# EAGLE design extruder-controller (EAGLE 5.02)
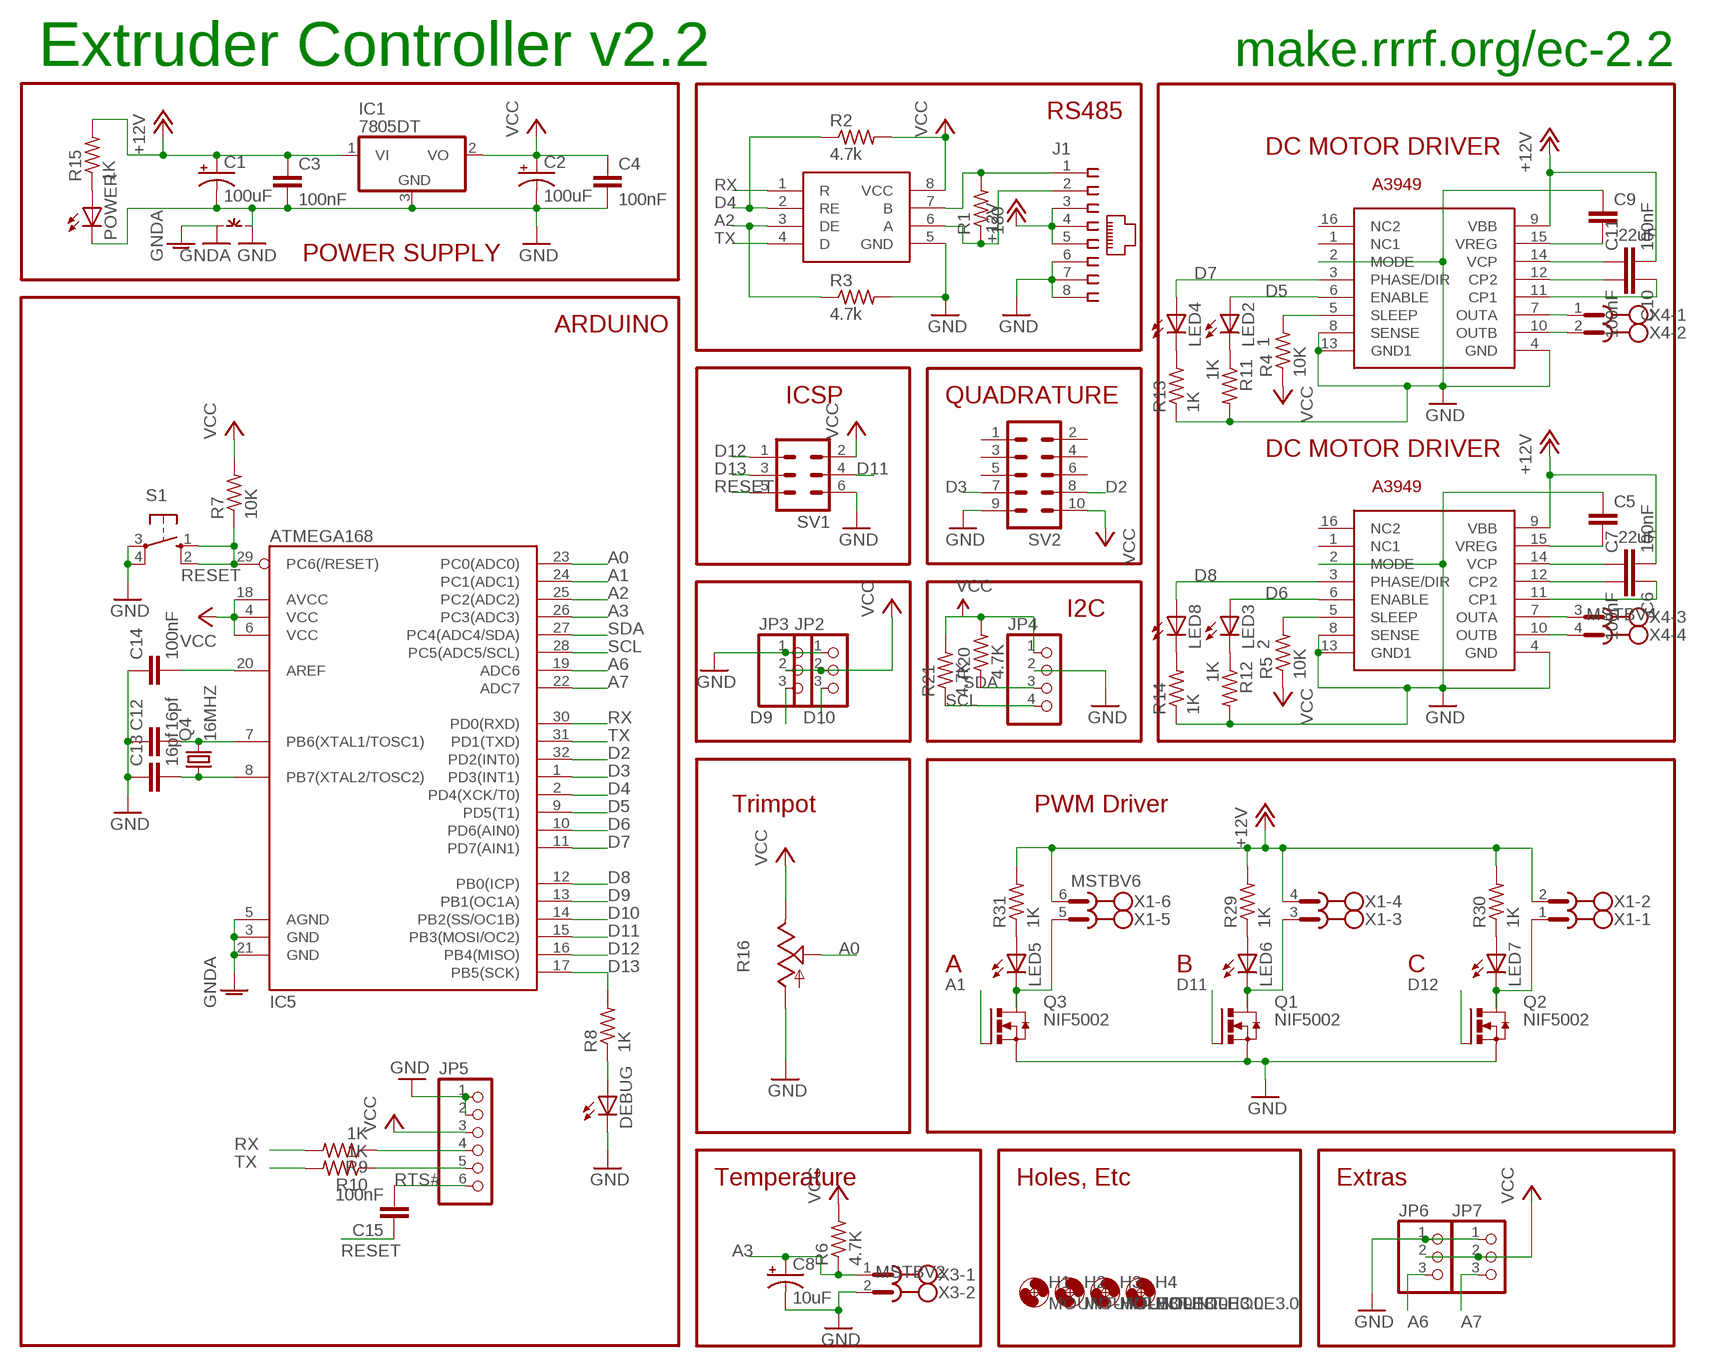
[diagram p0: schematic, sheet 1]

## Parts
C1  100uF  CPOL-USUD-10X10  [UD-10X10_NICHICON]
C2  100uF  CPOL-USUD-10X10  [UD-10X10_NICHICON]
C3  100nF  C-EUC1206  [C1206]
C4  100nF  C-EUC1206  [C1206]
C5  .22uF  C-EUC1206K  [C1206K]
C6  100nF  C-EUC1206K  [C1206K]
C7  100nF  C-EUC1206K  [C1206K]
C8  10uF  CPOL-USUD-6,3X5,8  [UD-6,3X5,8_NICHICON]
C9  .22uF  C-EUC1206K  [C1206K]
C10  100nF  C-EUC1206K  [C1206K]
C11  100nF  C-EUC1206K  [C1206K]
C12  16pf  C-EUC1206  [C1206]
C13  16pf  C-EUC1206  [C1206]
C14  100nF  C-EUC1206  [C1206]
C15  100nF  C-EUC1206  [C1206]
DEBUG  LEDCHIPLED_1206  [CHIPLED_1206]
H1  MOUNT-HOLE3.0  [3,0]
H2  MOUNT-HOLE3.0  [3,0]
H3  MOUNT-HOLE3.0  [3,0]
H4  MOUNT-HOLE3.0  [3,0]
IC1  7805DT  [TO252]
IC2  A3949  [SO16W]
IC3  A3949  [SO16W]
IC4  SN75176ASOIC  [SO08]
IC5  ATMEGA168  [TQFP32-08]
J1  520426-4  [520426-4]
JP2  PINHD-1X3  [1X03]
JP3  PINHD-1X3  [1X03]
JP4  PINHD-1X4  [1X04]
JP5  PINHD-1X6  [1X06]
JP6  PINHD-1X3  [1X03]
JP7  PINHD-1X3  [1X03]
LED2  1  LEDCHIPLED_1206  [CHIPLED_1206]
LED3  2  LEDCHIPLED_1206  [CHIPLED_1206]
LED4  LEDCHIPLED_1206  [CHIPLED_1206]
LED5  LEDCHIPLED_1206  [CHIPLED_1206]
LED6  LEDCHIPLED_1206  [CHIPLED_1206]
LED7  LEDCHIPLED_1206  [CHIPLED_1206]
LED8  LEDCHIPLED_1206  [CHIPLED_1206]
POWER  LEDCHIPLED_1206  [CHIPLED_1206]
Q1  NIF5002  N-HEXFET-2D_SOT232-  [SOT223]
Q2  NIF5002  N-HEXFET-2D_SOT232-  [SOT223]
Q3  NIF5002  N-HEXFET-2D_SOT232-  [SOT223]
Q4  16MHZ  CRYSTALHC49S  [HC49/S]
R1  180  R-US_R1206  [R1206]
R2  4.7k  R-US_R1206  [R1206]
R3  4.7k  R-US_R1206  [R1206]
R4  10K  R-US_R1206  [R1206]
R5  10K  R-US_R1206  [R1206]
R6  4.7K  R-US_M1206  [M1206]
R7  10K  R-US_R1206  [R1206]
R8  1K  R-US_R1206  [R1206]
R9  1K  R-US_R1206  [R1206]
R10  1K  R-US_R1206  [R1206]
R11  1K  R-US_R1206  [R1206]
R12  1K  R-US_R1206  [R1206]
R13  1K  R-US_R1206  [R1206]
R14  1K  R-US_R1206  [R1206]
R15  1K  R-US_R1206  [R1206]
R16  TRIM_US-B25P  [B25P]
R20  4.7K  R-US_R1206  [R1206]
R21  4.7K  R-US_R1206  [R1206]
R29  1K  R-US_R1206  [R1206]
R30  1K  R-US_R1206  [R1206]
R31  1K  R-US_M1206  [M1206]
S1  10-XX  [B3F-10XX]
SV1  ML6  [ML6]
SV2  ML10  [ML10]
X1  MSTBV6  [MSTBV6]
X3  MSTBV2  [MSTBV2]
X4  MSTBV4  [MSTBV4]
~NUDEV~1  GND-GNDA  [GND-GNDA]

## Nets
+12V [power]: C1.+ C3.1 C7.2 C11.2 IC1.1(VI) IC2.9(VBB) IC3.9(VBB) J1.3 J1.4 J1.5 R15.2 R29.2 R30.2 R31.2 X1.2 X1.4 X1.6
A0: IC5.23(PC0(ADC0)) R16.S
A1: IC5.24(PC1(ADC1)) Q3.1(G)
A2: IC4.3(DE) IC5.25(PC2(ADC2)) R3.1
A3: C8.+ IC5.26(PC3(ADC3)) R6.1 X3.1
A6: IC5.19(ADC6) JP6.3
A7: IC5.22(ADC7) JP7.3
D2: IC5.32(PD2(INT0)) SV2.8
D3: IC5.1(PD3(INT1)) SV2.7
D4: IC4.2(RE) IC5.2(PD4(XCK/T0)) R2.1
D5: IC2.6(ENABLE) IC5.9(PD5(T1)) LED2.A
D6: IC3.6(ENABLE) IC5.10(PD6(AIN0)) LED3.A
D7: IC2.3(PHASE/DIR) IC5.11(PD7(AIN1)) LED4.A
D8: IC3.3(PHASE/DIR) IC5.12(PB0(ICP)) LED8.A
D9: IC5.13(PB1(OC1A)) JP3.3
D10: IC5.14(PB2(SS/OC1B)) JP2.3
D11: IC5.15(PB3(MOSI/OC2)) Q1.1(G) SV1.4
D12: IC5.16(PB4(MISO)) Q2.1(G) SV1.1
D13: IC5.17(PB5(SCK)) R8.2 SV1.3
GND [power]: C1.- C2.- C3.2 C4.2 C5.1 C8.- C9.1 C12.1 C13.1 C14.1 DEBUG.C IC1.3(GND) IC2.2(MODE) IC2.4(GND) IC2.8(SENSE) IC2.13(GND1) IC3.2(MODE) IC3.4(GND) IC3.8(SENSE) IC3.13(GND1) IC4.5(GND) J1.6 J1.7 J1.8 JP2.1 JP3.1 JP4.2 JP5.1 JP5.2 JP6.1 JP7.1 POWER.C Q1.3(S) Q2.3(S) Q3.3(S) R3.2 R11.2 R12.2 R13.1 R14.1 R16.A S1.3(P) S1.4(P1) SV1.6 SV2.9 X3.2 ~NUDEV~1.GND
GNDA: IC5.3(GND) IC5.5(AGND) IC5.21(GND) ~NUDEV~1.GNDA
N$1: IC4.7(B) J1.1 R1.2
N$2: IC4.6(A) J1.2 R1.1
N$3: C9.2 IC2.15(VREG)
N$4 [motors]: IC2.7(OUTA) X4.1
N$5 [motors]: IC2.10(OUTB) X4.2
N$6: C10.2 IC2.12(CP2)
N$7: C10.1 IC2.11(CP1)
N$8: DEBUG.A R8.1
N$9: C11.1 IC2.14(VCP)
N$10 [motors]: IC3.7(OUTA) X4.3
N$11: C5.2 IC3.15(VREG)
N$12: IC2.5(SLEEP) R4.2
N$13: C6.2 IC3.12(CP2)
N$14: C6.1 IC3.11(CP1)
N$15: C7.1 IC3.14(VCP)
N$16: IC3.5(SLEEP) R5.2
N$17 [motors]: IC3.10(OUTB) X4.4
N$18: LED2.C R11.1
N$19: LED3.C R12.1
N$20: C14.2 IC5.20(AREF)
N$21: JP5.5 R10.1
N$22: JP5.4 R9.1
N$23: LED4.C R13.2
N$24: LED8.C R14.2
N$25: POWER.A R15.1
N$31: C12.2 IC5.7(PB6(XTAL1/TOSC1)) Q4.2
N$32: C13.2 IC5.8(PB7(XTAL2/TOSC2)) Q4.1
N$33 [power]: LED7.C Q2.2(D) Q2.4(D) X1.1
N$34 [power]: LED6.C Q1.2(D) Q1.4(D) X1.3
N$35 [power]: LED5.C Q3.2(D) Q3.4(D) X1.5
N$41: LED5.A R31.1
N$42: LED6.A R29.1
N$43: LED7.A R30.1
RESET: C15.1 IC5.29(PC6(/RESET)) R7.1 S1.1(S) S1.2(S1) SV1.5
RTS#: C15.2 JP5.6
RX: IC4.1(R) IC5.30(PD0(RXD)) R9.2
SCL: IC5.28(PC5(ADC5/SCL)) JP4.4 R21.1
SDA: IC5.27(PC4(ADC4/SDA)) JP4.3 R20.1
TX: IC4.4(D) IC5.31(PD1(TXD)) R10.2
VCC: C2.+ C4.1 IC1.2(VO) IC4.8(VCC) IC5.4(VCC) IC5.6(VCC) IC5.18(AVCC) JP2.2 JP3.2 JP4.1 JP5.3 JP6.2 JP7.2 R2.2 R4.1 R5.1 R6.2 R7.2 R16.E R20.2 R21.2 SV1.2 SV2.10
Unconnected: IC2.1(NC1) IC2.16(NC2) IC3.1(NC1) IC3.16(NC2) SV2.1 SV2.2 SV2.3 SV2.4 SV2.5 SV2.6

## Notes on the sheet
- make.rrrf.org/ec-2.2
- Extruder Controller v2.2
- RS485
- DC MOTOR DRIVER
- POWER SUPPLY
- ARDUINO
- ICSP | QUADRATURE
- DC MOTOR DRIVER
- I2C
- Trimpot | PWM Driver
- A | B | C
- Temperature | Holes, Etc | Extras

## Library data of the parts
C1 C2 C8 = rcl:CPOL-US: POLARIZED CAPACITOR, American symbol
C3-C7 C9-C11 C14 = rcl:C-EU: CAPACITOR, European symbol
C12 C13 C15 = resistor:C-EU: CAPACITOR, European symbol
DEBUG LED2-LED8 POWER = led:LED: LED OSRAM: - CHIPLED LG R971, LG N971, LY N971, LG Q971, LY Q971, LO R971, LY R971 LH N974, LH R974 LS Q976, LO Q976, LY Q976 LO Q996 - Hyper CHIPLED LW Q18S LB Q993, LB Q99A, LB R99A - SideLED LS A670, LO A670, LY A670, LG A670, LP A670 LB A673, LV A673, LT A673, LW A673 LH A674 LY A675 LS A676, LA A676, LO A676, LY A676, LW A676 LS A679, LY A679, LG A679 - Hyper Micro SIDELED® LS Y876, LA Y876, LO Y876, LY Y876 LT Y87S - SmartLED LW L88C, LW L88S LB L89C, LB L89S, LG L890 LS L89K, LO L89K, LY L89K LS L896, LA L896, LO L896, LY L896 - TOPLED LS T670, LO T670, LY T670, LG T670, LP T670 LSG T670, LSP T670, LSY T670, LOP T670, LYG T670 LG T671, LOG T671, LSG T671 LB T673, LV T673, LT T673, LW T673 LH T674 LS T676, LA T676, LO T676, LY T676, LB T676, LH T676, LSB T676, LW T676 LB T67C, LV T67C, LT T67C, LS T67K, LO T67K, LY T67K, LW E67C LS E67B, LA E67B, LO E67B, LY E67B, LB E67C, LV E67C, LT E67C LW T67C LS T679, LY T679, LG T679 LS T770, LO T770, LY T770, LG T770, LP T770 LB T773, LV T773, LT T773, LW T773 LH T774 LS E675, LA E675, LY E675, LS T675 LS T776, LA T776, LO T776, LY T776, LB T776 LHGB T686 LT T68C, LB T68C - Hyper Mini TOPLED® LB M676 - Mini TOPLED Santana® LG M470 LS M47K, LO M47K, LY M47K Source: http://www.osram.convergy.de - LUMILED® LXK2-PW12-R00, LXK2-PW12-S00, LXK2-PW14-U00, LXK2-PW14-V00 LXK2-PM12-R00, LXK2-PM12-S00, LXK2-PM14-U00 LXK2-PE12-Q00, LXK2-PE12-R00, LXK2-PE12-S00, LXK2-PE14-T00, LXK2-PE14-U00 LXK2-PB12-K00, LXK2-PB12-L00, LXK2-PB12-M00, LXK2-PB14-N00, LXK2-PB14-P00, LXK2-PB14-Q00 LXK2-PR12-L00, LXK2-PR12-M00, LXK2-PR14-Q00, LXK2-PR14-R00 LXK2-PD12-Q00, LXK2-PD12-R00, LXK2-PD12-S00 LXK2-PH12-R00, LXK2-PH12-S00 LXK2-PL12-P00, LXK2-PL12-Q00, LXK2-PL12-R00 Source: www.luxeon.com
H1-H4 = holes:MOUNT-HOLE: MOUNTING HOLE with drill center marker
IC1 = linear:78*: Positive VOLTAGE REGULATOR Source: http://cache.national.com/ds/LM/LM78L05.pdf http://www.fairchildsemi.com/ds/LM/LM7805.pdf
IC2 IC3 = reprap:A3949
IC4 = reprap:SN75176A
IC5 = SparkFun:ATMEGA168
J1 = con-amp:520426-4: AMP connector
JP2 JP3 JP6 JP7 = pinhead:PINHD-1X3: PIN HEADER
JP4 = pinhead:PINHD-1X4: PIN HEADER
JP5 = pinhead:PINHD-1X6: PIN HEADER
Q1-Q3 = transistor-power:N-HEXFET-2D_?-*: HEXFET® Power MOSFET 2 Drain connects http://www.irf.com/product-info/datasheets/data/irll014n.pdf
Q4 = crystal:CRYSTAL: CRYSTAL
R1-R5 R7-R10 R15 = resistor:R-US_: RESISTOR, American symbol
R6 R11-R14 R20 R21 R29-R31 = rcl:R-US_: RESISTOR, American symbol
R16 = pot:TRIM_US-: POTENTIOMETER
S1 = switch-omron:10-XX: OMRON SWITCH
SV1 = con-harting-ml:ML6: HARTING
SV2 = con-harting-ml:ML10: HARTING
X1 = con-phoenix-508:MSTBV6: PHOENIX
X3 = con-phoenix-508:MSTBV2: PHOENIX
X4 = con-phoenix-508:MSTBV4: PHOENIX
~NUDEV~1 = supply1:GND-GNDA: Example of GND--GNDA NET-Connetor for more info see description in package

## Net classes
0 default: width 0.305 mm
1 power: width 1.27 mm
2 motors: width 0.762 mm

## Board
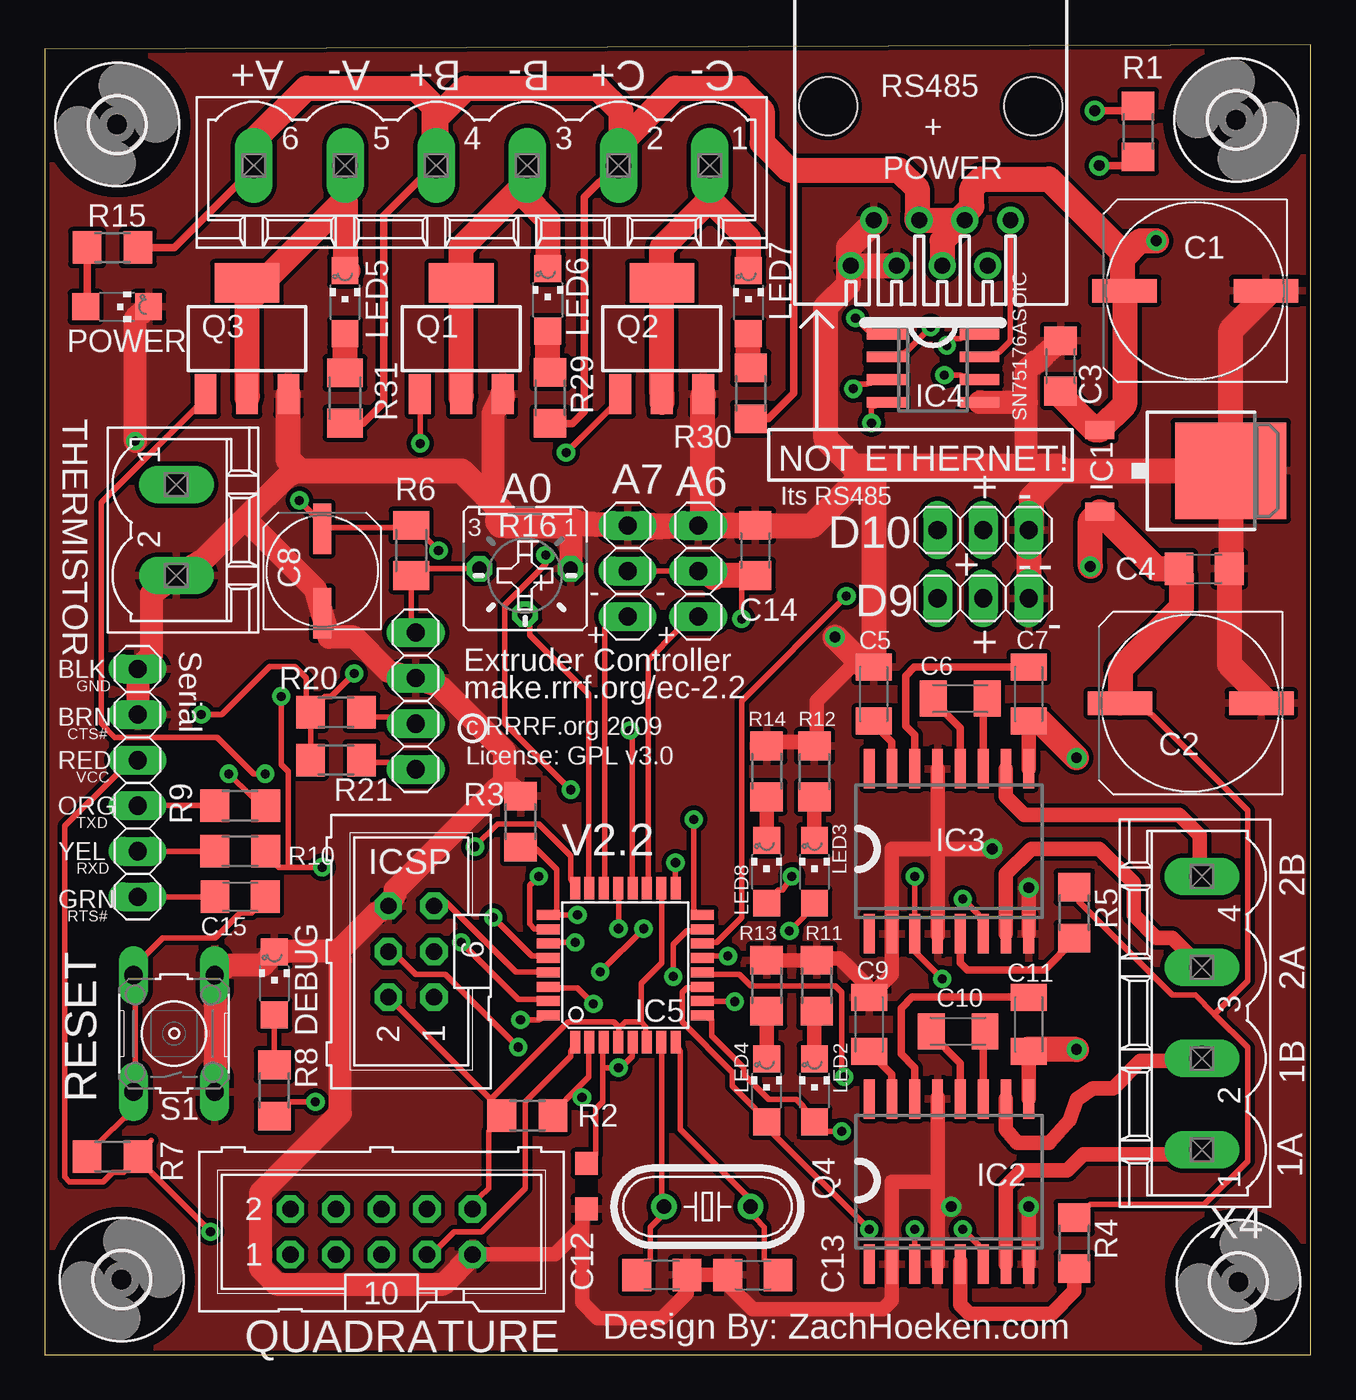
[diagram p1: board, top side]
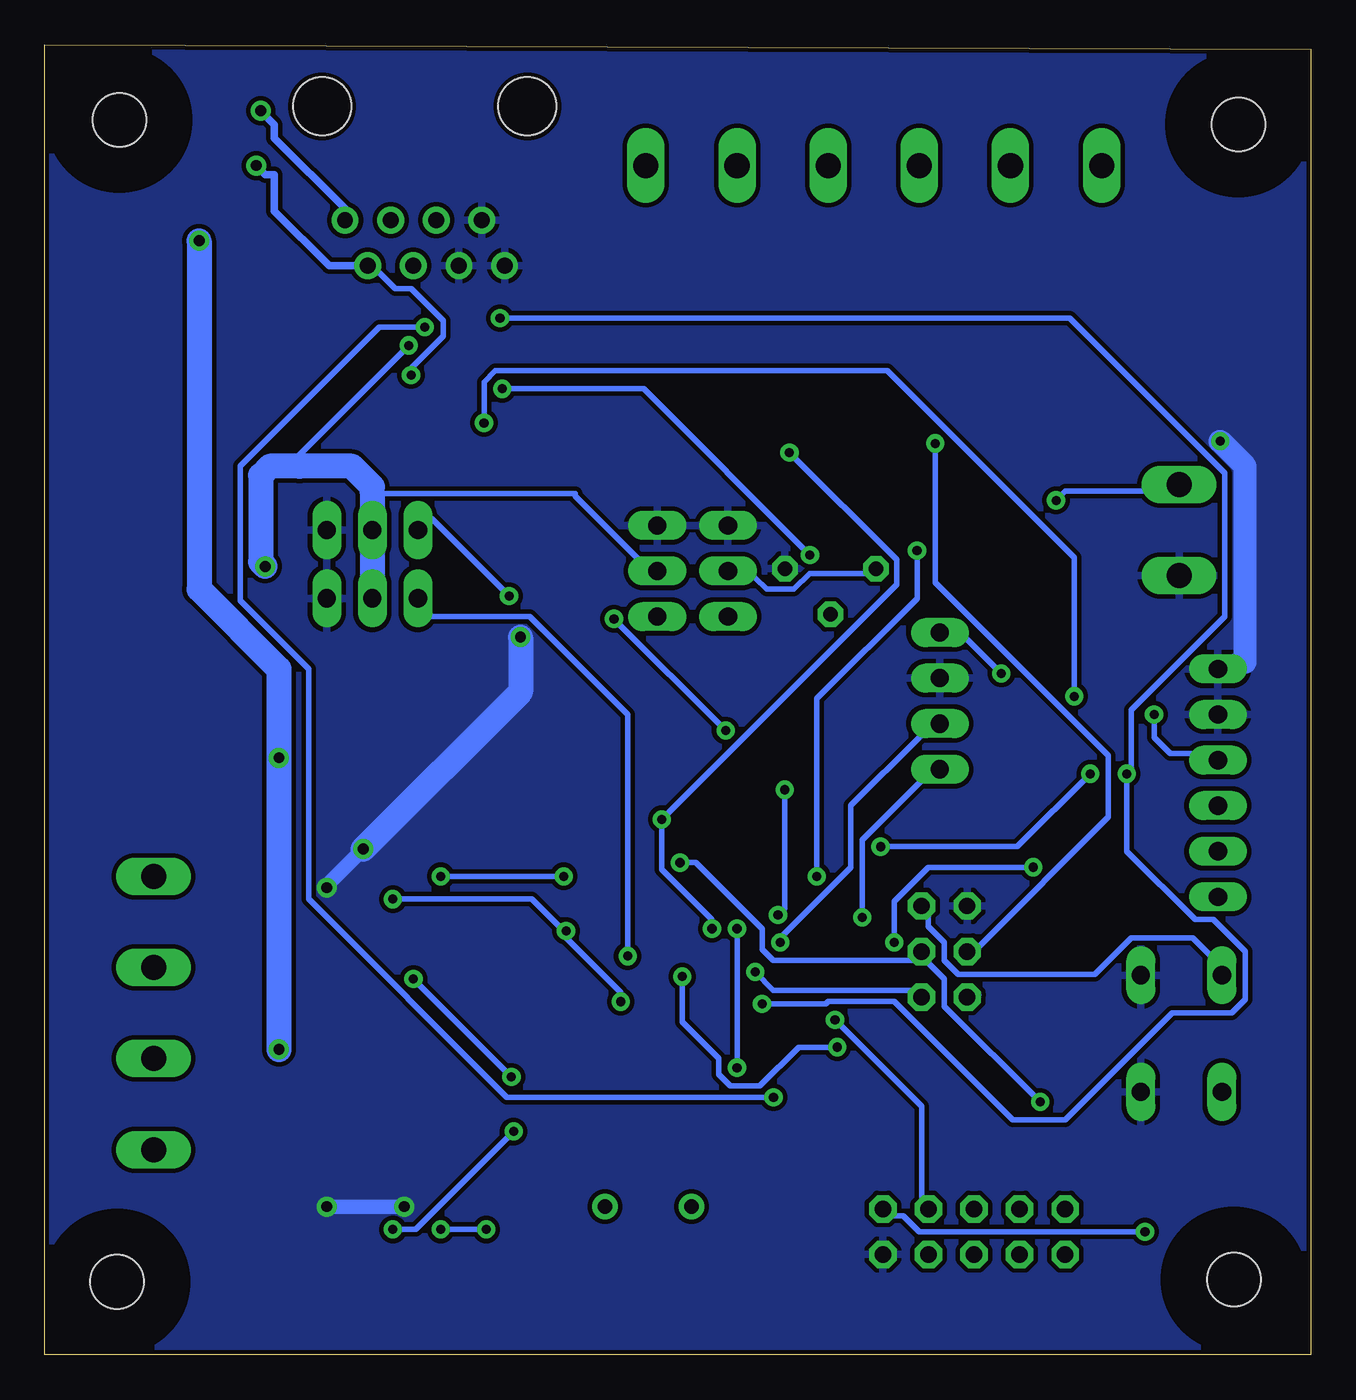
[diagram p2: board, bottom side, seen from below]

Size 70.54 x 73.02 mm. Coordinates in mm from the lower left corner, seen from the top.
Outline: 0,0 70.54,0 70.54,73.02 0,72.76 0,0
Copper layers (1*16): Top 0.035mm / dielectric 1.5mm / Bottom 0.035mm
Design rules "reprap": minimum track width 8mil, minimum drill 20mil, track to track 10mil, track to pad 10mil, pad to pad 10mil, via to via 10mil, smd to smd 8mil, copper to edge 10mil, drill to drill 8mil, minimum pad ring 12mil, minimum via ring 10mil, stop-mask expansion 4mil, vias tented up to drill 25mil, thermal gap 10mil

### Footprints (pad centres in the part's own frame; a part is rotated, then mirrored left to right if it is on the bottom)
UD-10X10_NICHICON = smd 3.6 x 1.3: + 3.925,0; - -3.95,0
C1206 = smd 1.6 x 1.8: 1 -1.4,0; 2 1.4,0
C1206K = smd 1.5 x 2: 1 -1.5,0; 2 1.5,0
UD-6,3X5,8_NICHICON = smd 2.8 x 1: + 2.35,0; - -2.35,0
CHIPLED_1206 = smd 1.5 x 1.5: A 0,-1.75; C 0,1.75
3,0 = hole 3: 0,0
TO252 = smd 1 x 1.6: 1 -2.28,-4.8; 2 2.28,-4.8 | smd 5.4 x 6.2: 3 0,2.5
SO16W = smd 0.6 x 2.2: 1 -4.445,-4.6; 2 -3.175,-4.6; 3 -1.905,-4.6; 4 -0.635,-4.6; 5 0.635,-4.6; 6 1.905,-4.6; 7 3.175,-4.6; 8 4.445,-4.6; 9 4.445,4.6; 10 3.175,4.6; 11 1.905,4.6; 12 0.635,4.6; 13 -0.635,4.6; 14 -1.905,4.6; 15 -3.175,4.6; 16 -4.445,4.6
SO08 = smd 0.6 x 2.2: 1 -1.905,-2.6; 2 -0.635,-2.6; 3 0.635,-2.6; 4 1.905,-2.6; 5 1.905,2.6; 6 0.635,2.6; 7 -0.635,2.6; 8 -1.905,2.6
TQFP32-08 = smd 1.27 x 0.559: 1 -4.293,2.8; 2 -4.293,2; 3 -4.293,1.2; 4 -4.293,0.4; 5 -4.293,-0.4; 6 -4.293,-1.2; 7 -4.293,-2; 8 -4.293,-2.8; 17 4.293,-2.8; 18 4.293,-2; 19 4.293,-1.2; 20 4.293,-0.4; 21 4.293,0.4; 22 4.293,1.2; 23 4.293,2; 24 4.293,2.8 | smd 0.559 x 1.27: 9 -2.8,-4.293; 10 -2,-4.293; 11 -1.2,-4.293; 12 -0.4,-4.293; 13 0.4,-4.293; 14 1.2,-4.293; 15 2,-4.293; 16 2.8,-4.293; 25 2.8,4.293; 26 2,4.293; 27 1.2,4.293; 28 0.4,4.293; 29 -0.4,4.293; 30 -1.2,4.293; 31 -2,4.293; 32 -2.8,4.293
520426-4 = drill 0.889 round: 1 -4.445,6.35; 2 -3.175,8.89; 3 -1.905,6.35; 4 -0.635,8.89; 5 0.635,6.35; 6 1.905,8.89; 7 3.175,6.35; 8 4.445,8.89 | hole 3.251: -5.715,0; 5.715,0
1X03 = drill 1.016 long: 1 -2.54,0; 2 0,0; 3 2.54,0
1X04 = drill 1.016 long: 1 -3.81,0; 2 -1.27,0; 3 1.27,0; 4 3.81,0
1X06 = drill 1.016 long: 1 -6.35,0; 2 -3.81,0; 3 -1.27,0; 4 1.27,0; 5 3.81,0; 6 6.35,0
SOT223 = smd 1.219 x 2.235: 1 -2.311,-3.099; 2 0,-3.099; 3 2.311,-3.099 | smd 3.6 x 2.2: 4 0,3.099
HC49/S = drill 0.813 round: 1 -2.413,0; 2 2.413,0
R1206 = smd 1.6 x 1.803: 1 -1.422,0; 2 1.422,0
M1206 = smd 1.6 x 2: 1 -1.4,0; 2 1.4,0
B25P = drill 0.813 octagon: A -2.54,0; E 2.54,0; S 0,2.54
B3F-10XX = drill 1.016 long: 1 -3.251,2.261; 2 3.251,2.261; 3 -3.251,-2.261; 4 3.251,-2.261
ML6 = drill 0.914 octagon: 1 -2.54,-1.27; 2 -2.54,1.27; 3 0,-1.27; 4 0,1.27; 5 2.54,-1.27; 6 2.54,1.27
ML10 = drill 0.914 octagon: 1 -5.08,-1.27; 2 -5.08,1.27; 3 -2.54,-1.27; 4 -2.54,1.27; 5 0,-1.27; 6 0,1.27; 7 2.54,-1.27; 8 2.54,1.27; 9 5.08,-1.27; 10 5.08,1.27
MSTBV6 = drill 1.397 long: 1 -12.7,0; 2 -7.62,0; 3 -2.54,0; 4 2.54,0; 5 7.62,0; 6 12.7,0
MSTBV2 = drill 1.397 long: 1 -2.54,0; 2 2.54,0
MSTBV4 = drill 1.397 long: 1 -7.62,0; 2 -2.54,0; 3 2.54,0; 4 7.62,0
GND-GNDA = smd 1.27 x 1.27: GND -1.27,0; GNDA 1.27,0

### Placement (x,y rotation side)
C1  64.1,59.3 180 top
C2  63.84,36.32 180 top
C3  56.6,55.11 90 top
C4  64.6,43.81 0 top
C5  46.19,36.82 270 top
C6  51.02,36.57 180 top
C7  54.83,36.82 270 top
C8  15.46,43.68 90 top
C9  45.94,18.41 270 top
C10  50.89,18.03 180 top
C11  54.83,18.41 270 top
C12  34.38,4.44 180 top
C13  39.46,4.44 0 top
C14  39.59,44.83 270 top
C15  10.88,25.52 180 top
DEBUG  12.79,20.7 0 top
H1  4.28,4.19 0 top
H2  4.03,68.58 0 top
H3  66.51,4.06 0 top
H4  66.38,68.83 90 top
IC1  63.59,49.27 270 top
IC2  50.38,9.65 0 top
IC3  50.38,28.06 0 top
IC4  49.49,54.99 270 top
IC5  32.35,21.71 90 top
J1  49.37,69.59 180 top
JP2  52.29,45.97 180 top
JP3  52.29,42.16 180 top
JP4  20.66,36.44 270 top
JP5  5.17,31.87 270 top
JP6  36.41,43.68 270 top
JP7  32.47,43.68 270 top
LED2  42.89,14.73 0 top
LED3  42.89,26.92 0 top
LED4  40.22,14.73 0 top
LED5  16.73,58.67 0 top
LED6  28.03,58.8 0 top
LED7  39.2,58.67 0 top
LED8  40.22,26.92 0 top
POWER  4.03,58.41 270 top
Q1  23.2,56.64 0 top
Q2  34.38,56.64 0 top
Q3  11.27,56.64 0 top
Q4  36.92,8.25 180 top
R1  60.92,68.19 90 top
R2  26.89,13.33 180 top
R3  26.5,29.71 90 top
R4  57.37,6.22 270 top
R5  57.37,24.63 270 top
R6  20.41,44.83 270 top
R7  3.77,11.04 0 top
R8  12.79,14.73 270 top
R9  10.88,30.6 0 top
R10  10.88,28.06 0 top
R11  43.02,20.57 90 top
R12  42.89,32.51 90 top
R13  40.22,20.57 270 top
R14  40.22,32.51 270 top
R15  3.77,61.72 0 top
R16  26.76,43.81 180 top
R20  16.22,35.81 180 top
R21  16.22,33.14 180 top
R29  28.16,53.33 270 top
R30  39.33,53.59 270 top
R31  16.73,53.33 270 top
S1  7.2,17.9 90 top
SV1  20.41,22.47 90 top
SV2  18.76,6.85 0 top
X1  24.35,66.29 180 top
X3  7.33,45.97 270 top
X4  64.48,19.05 90 top
~NUDEV~1  30.19,9.39 90 top

### Tracks (layer width: path | path; a pad name or v marks a point on that pad's centre or on a via)
+12V  (via drill 0.6)
  Top 0.406: R31.2 17.74,51.93 18.89,53.08 18.89,63.49 21.68,66.29 | R29.2 29.4,51.91 30.06,52.57 30.06,64.51 31.84,66.29 | R30.2 40.32,52.17 41.74,53.59 41.74,66.04 | X1.6 11.77,66.29 7.2,61.72 R15.2
  Top 0.813: 54.7,17.01 54.8,16.91 | 54.8,16.91 C11.2 | IC2.9 54.83,16.89 54.8,16.91 | C7.2 54.93,35.32 54.95,35.3 54.83,35.17 IC3.9
  Top 1.397: X1.6 11.65,67.69 14.57,70.61 20.66,70.61 21.68,69.59 21.68,66.29 X1.4 21.81,68.96 23.46,70.61 30.82,70.61 32.09,69.34 32.09,66.54 31.84,66.29 X1.2 31.97,67.43 35.14,70.61 38.7,70.61 39.97,69.34 39.97,67.56 41.49,66.04 41.74,66.04 47.59,66.04 48.6,65.02 48.6,63.49 48.86,63.24 | 48.6,63.24 J1.5 48.86,63.24 | 48.86,63.24 51.14,63.24 | 51.14,63.24 J1.3 | J1.4 50,62.1 50.51,62.61 | 51.14,63.24 50.51,62.61 | 50.51,62.61 50.38,62.73 51.65,64 51.65,65.02 52.16,65.53 55.97,65.53 60.03,61.46 60.03,61.08 | 60.03,61.08 60.03,59.43 60.16,59.3 C1.+ 60.17,52.97 58.76,51.56 58.77,51.55 IC1.1 58.52,51.55 56.48,53.59 C3.1 | v57.49,17.01 54.7,17.01 | v61.94,62.1 61.05,62.1 60.03,61.08 | 54.93,35.32 55.44,35.32 v57.49,33.27
  Bottom 1.397: v61.94,62.1 61.94,42.67 57.49,38.22 v57.49,33.27 v57.49,17.01
A0
  Top 0.305: IC5.23 30.32,26.54 30.32,36.82 27.01,40.13 27.01,40.63 R16.S
A1  (via drill 0.51)
  Top 0.305: v23.96,28.32 25.23,29.59 27.52,29.59 29.3,27.81 29.3,26.54 IC5.24 | v12.28,32.38 11.65,32.38 9.61,34.41 3.9,34.41 3.14,35.17 3.14,47.49 8.47,52.83 Q3.1
  Bottom 0.305: v23.96,28.32 16.34,28.32 v12.28,32.38
A2  (via drill 0.51)
  Top 0.305: R3.1 27.39,28.19 28.54,27.05 28.54,24.76 IC5.25 28.66,24.51 v29.68,24.51 | v45.05,53.84 45.3,54.1 45.81,54.1 IC4.3 | v27.9,44.57 27.9,44.06 25.62,41.78 25.62,35.17 v29.3,31.49
  Bottom 0.305: v45.05,53.84 37.17,53.84 v27.9,44.57 | v29.3,31.49 29.3,24.89 v29.68,24.51
A3  (via drill 0.51)
  Top 0.305: v27.52,26.66 27.01,26.16 27.01,24 27.27,23.74 27.52,23.74 IC5.26 | v21.93,44.83 21.3,45.46 R6.1 19.52,46.1 15.84,46.1 C8.+ 15.07,46.73 v14.19,47.62
  Bottom 0.305: v27.52,26.66 27.52,36.57 21.93,42.16 v21.93,44.83 | v14.19,47.62 13.68,48.13 9.36,48.13 X3.1
A6
  Top 0.305: IC5.19 33.62,26.54 33.62,38.73 35.27,40.38 JP6.3
A7
  Top 0.305: IC5.22 31.2,26.54 31.2,40.51 JP7.3
D2  (via drill 0.51)
  Top 0.305: v26.5,18.66 27.52,18.66 IC5.32
  Bottom 0.305: v26.5,18.66 21.68,13.84 21.68,8.76 SV2.8
D3
  Top 0.305: IC5.1 29.3,16.89 29.3,16.63 26.76,14.09 26.76,9.27 24.35,6.85 22.82,6.85 21.93,5.96 SV2.7
D4  (via drill 0.51)
  Top 0.305: 29.55,14.73 29.05,14.22 R2.1 | 29.55,14.73 30.32,15.49 30.32,16.89 IC5.2 | v49.37,57.27 47.97,55.88 IC4.2 | 29.55,14.73 v29.93,14.35
  Bottom 0.305: v49.37,57.27 51.91,57.27 59.65,49.52 59.65,42.03 55.84,38.22 55.84,25.39 44.79,14.35 v29.93,14.35
D5  (via drill 0.51)
  Top 0.305: IC5.9 37.17,18.66 37.17,17.78 38.95,16 38.95,15.62 40.35,14.22 41.87,14.22 42.25,13.84 LED2.A 43.52,12.44 v44.41,12.44 | v51.14,6.98 52.03,6.09 IC2.6
  Bottom 0.305: v51.14,6.98 49.87,6.98 v44.41,12.44
D6  (via drill 0.51)
  Top 0.305: v38.44,19.68 37.17,19.68 IC5.10 | v41.49,23.62 42.25,24.38 LED3.A | v51.14,25.39 52.03,24.51 IC3.6
  Bottom 0.305: v38.44,19.68 38.44,20.19 41.49,23.24 v41.49,23.62 41.87,23.87 43.4,25.39 v51.14,25.39
D7  (via drill 0.51)
  Top 0.305: IC5.11 36.03,20.44 35.78,20.44 35.52,20.19 35.52,18.54 38.32,15.74 38.32,14.98 39.59,13.71 LED4.A 40.6,12.31 v45.94,6.98 | v48.48,6.98 IC2.3
  Bottom 0.305: v45.94,6.98 v48.48,6.98
D8  (via drill 0.51)
  Top 0.305: v44.54,15.49 44.41,15.62 44.41,20.19 44.03,20.57 39.33,20.57 38.7,21.2 37.17,21.2 IC5.12 | v50,20.95 48.48,22.47 IC3.3 v48.48,26.66 | v41.62,26.66 41.11,25.9 40.86,25.9 LED8.A
  Bottom 0.305: v44.54,15.49 v50,20.95 | v48.48,26.66 v41.62,26.66
D9  (via drill 0.51)
  Top 0.305: v38.06,22.22 37.17,22.22 IC5.13
  Bottom 0.305: v38.06,22.22 38.06,35.68 43.52,41.14 48.98,41.14 JP3.3
D10  (via drill 0.51)
  Top 0.305: v44.67,42.29 38.82,36.44 38.82,24.38 37.43,22.98 37.17,22.98 IC5.14
  Bottom 0.305: v44.67,42.29 48.98,46.6 JP2.3
D11  (via drill 0.51)
  Top 0.305: v35.01,21.08 35.01,22.86 35.78,23.62 36.03,23.62 IC5.15 | v26.38,17.14 22.31,21.2 20.66,21.2 19.77,22.09 SV1.4 | v20.92,50.79 20.92,52.45 Q1.1
  Bottom 0.305: v35.01,21.08 35.01,18.54 32.98,16.5 32.98,15.62 32.35,14.98 30.7,14.98 28.54,17.14 v26.38,17.14 | v20.92,50.79 20.92,43.05 11.27,33.4 11.27,29.97 18.5,22.73 SV1.4
D12  (via drill 0.51)
  Top 0.305: v36.16,29.84 36.16,24.76 IC5.16 | v29.05,50.29 31.59,52.83 Q2.1 | v30.95,21.33 v33.36,23.74
  Bottom 0.305: v29.05,50.29 23.08,44.32 23.08,42.92 v36.16,29.84 36.16,27.05 33.36,24.25 v33.36,23.74 | v30.95,21.33 29.93,20.32 22.31,20.32 SV1.1
D13  (via drill 0.51)
  Top 0.305: v35.14,27.43 35.14,26.54 IC5.17 | v15.07,14.09 13.68,14.09 R8.2
  Bottom 0.305: v35.14,27.43 34.25,27.43 30.57,23.74 30.57,22.6 29.93,21.97 22.19,21.97 SV1.3 21.3,21.84 20.41,20.95 20.41,19.43 v15.07,14.09
GND  (via drill 0.51, 0.6)
  Top 0.813: 49.75,14.35 IC2.13 49.75,9.65 | 49.75,9.65 49.75,8 | 49.75,8 IC2.4 | 49.75,9.65 47.21,9.65 IC2.2 47.21,3.04 46.7,2.54 39.46,2.54 37.81,4.19 C13.1 35.9,4.44 35.78,4.32 | v54.83,8.25 IC2.8 | 49.75,8 v50.51,8.25 | 49.75,23.36 IC3.4 49.75,28.19 | 49.75,28.32 49.75,28.19 | 49.75,28.32 IC3.13 | 49.75,28.19 47.21,28.19 IC3.2 47.21,21.2 45.91,19.91 | v54.83,26.03 IC3.8 | v52.79,28.19 49.87,28.19 49.75,28.32 | 45.91,19.91 45.81,19.81 | 45.91,19.91 C9.1 45.94,20.44 44.29,22.09 43.02,22.09 R11.2 40.37,21.99 40.22,21.97 R13.1 | C5.1 44.9,38.32 43.02,36.44 43.02,34.28 42.89,34.16 | 42.89,34.16 R12.2 | 40.22,33.9 40.09,33.78 | 40.22,33.9 R14.1 | 42.89,34.16 40.48,34.16 40.22,33.9 | 35.78,4.32 35.78,4.31 | 35.78,4.32 C12.1 35.78,3.43 34.38,2.03 30.82,2.03 29.93,2.92 29.93,7.11 | 29.93,7.11 29.93,7.87 ~NUDEV~1.GND | SV2.9 28.41,5.58 29.93,7.11
  Top 1.27: 16.34,22.47 13.42,22.47 DEBUG.C 12.15,21.71 10.25,21.71 S1.4 9.49,19.55 9.49,16.25 S1.3 | 16.34,22.47 18.5,24.63 SV1.6 19.52,25.65 19.52,25.9 25.11,31.49 25.62,31.87 | 25.62,31.87 25.62,33.65 22.06,37.21 JP4.2 19.14,38.09 17.23,40 15.84,40 C8.- 15.07,42.67 11.14,46.6 | 25.62,31.87 R3.2 | 54.7,53.08 54.7,54.86 55.21,55.37 55.33,55.37 55.72,55.75 C3.2 | 54.7,49.52 54.7,53.08 | 54.7,53.08 IC4.5 | JP5.2 JP5.1 5.93,38.98 5.93,42.41 X3.2 8.85,44.32 11.14,46.6 | 11.14,46.6 13.55,49.02 14.19,49.27 | SV2.9 22.19,3.93 12.92,3.93 12.03,4.82 12.03,9.01 16.47,13.46 16.47,21.97 16.34,22.47 | v5.04,50.92 5.04,57.78 POWER.C | Q1.3 24.98,52.45 24.98,48.38 24.54,47.94 | 29.3,46.35 R16.A
  Top 1.397: 44.79,60.7 J1.8 J1.6 | J1.7 46.32,63.24 44.79,61.72 44.79,60.7 | 44.79,60.7 44.79,59.68 43.52,58.41 43.52,51.05 45.05,49.52 45.94,49.52 | 46.32,49.52 54.7,49.52 56.48,49.52 56.6,49.4 | 45.94,49.52 46.32,49.52 | 56.6,49.4 56.73,49.27 IC1.3 | IC1.3 66.13,49.27 | C1.- 68.05,59.29 68.16,59.18 66.09,57.1 IC1.3 | IC1.3 66.09,44.23 66.13,44.19 66,44.07 C4.2 66,38.47 67.91,36.57 67.79,36.46 C2.- | 54.95,45.97 JP2.1 | JP3.1 54.83,45.84 54.95,45.97 | 54.95,45.97 54.95,47.75 56.6,49.4 | 46.32,49.52 46.32,49.4 46.19,49.27 C5.1 45.71,38.32 v44.03,40 | 45.94,49.52 45.94,49.4 42.76,46.23 C14.1 | C14.1 36.66,46.22 36.66,53.46 36.69,53.49 Q2.3 | C14.1 33.87,46.23 33.74,46.1 JP6.1 JP7.1 29.43,46.35 | 25.49,53.33 25.51,53.36 Q1.3 | 25.36,46.22 25.36,46.48 25.36,47.11 24.54,47.94 23.2,49.27 14.19,49.27 13.55,49.91 13.55,53.46 13.58,53.49 Q3.3
  Top 1.676: 25.36,46.48 25.74,46.48 25.74,46.35 29.3,46.35 29.43,46.35
  Bottom 0.813: v50.51,8.25 v54.83,8.25 | v54.83,26.03 54.83,26.16 v52.79,28.19
  Bottom 1.27: v5.04,50.92 3.65,49.52 3.65,38.6 JP5.1
  Bottom 1.397: v44.03,40 44.03,36.95 v52.79,28.19
  pour Top: -0.93,74.16 71.46,74.16 71.46,-0.77 -0.93,-0.77
  pour Bottom: -0.93,74.16 71.46,74.16 71.46,-0.77 -0.93,-0.77
GNDA  (via drill 0.51)
  Top 0.305: 31.08,16 31.08,16.89 IC5.3 | 31.08,16 31.08,14.09 30.7,13.71 30.7,11.17 ~NUDEV~1.GNDA | v31.97,23.74 31.97,25.39 IC5.21 | 31.08,16 v31.97,16 32.35,16.25 32.73,16.63 32.73,16.89 IC5.5
  Bottom 0.305: v31.97,16 v31.97,23.74
N$1  (via drill 0.6)
  Top 0.305: IC4.7 53.17,55.88 53.81,56.51 J1.1
  Top 0.406: R1.2 61.02,69.62 61.05,69.59 60.8,69.34 v58.51,69.34
  Bottom 0.406: J1.1 53.81,63.88 57.75,67.81 57.75,68.58 v58.51,69.34
N$2  (via drill 0.51, 0.6)
  Top 0.305: v50.13,54.6 51.02,54.6 IC4.6
  Top 0.406: 61.02,66.77 61.05,66.8 | 61.02,66.77 R1.1 | v58.76,66.29 60.54,66.29 61.02,66.77
  Bottom 0.305: v50.13,54.6 50.13,54.99 48.35,56.76 48.35,57.65 50.13,59.43 51.02,59.43 51.91,60.32 J1.2
  Bottom 0.406: J1.2 54.7,60.7 57.75,63.75 57.75,65.78 58.26,65.78 v58.76,66.29
N$3
  Top 0.406: C9.2 45.94,16.89 47.21,15.62 IC2.15
N$4
  Top 0.813: IC2.7 53.56,9.39 54.45,10.28 56.98,10.28 57.87,11.17 64.22,11.17 X4.1
N$5
  Top 0.813: IC2.10 53.56,12.57 54.19,11.81 55.97,11.81 57.11,13.08 57.49,14.22 58.38,14.85 59.52,14.85 61.05,16.38 64.48,16.38 64.6,16.5 X4.2
N$6
  Top 0.406: C10.2 49.39,17.93 49.37,17.9 51.02,16.25 IC2.12
N$7
  Top 0.406: C10.1 52.39,18 52.29,17.9 IC2.11
N$8
  Top 0.305: R8.1 DEBUG.A
N$9
  Top 0.406: IC2.14 48.48,16 47.71,16.76 47.71,19.3 48.35,19.93 54.83,19.93 C11.1
N$10
  Top 0.813: IC3.7 53.56,26.79 54.95,28.19 58.76,28.19 60.67,26.28 60.67,24.51 61.94,23.24 62.83,23.24 X4.3
N$11
  Top 0.406: C5.2 46.19,35.17 47.21,34.16 IC3.15
N$12
  Top 0.813: R4.2 57.37,3.55 56.1,2.28 51.52,2.28 51.02,2.79 IC2.5 51.02,5.2
N$13
  Top 0.406: C6.2 49.52,36.47 49.49,36.44 51.02,34.92 IC3.12
N$14
  Top 0.406: C6.1 52.41,36.57 52.29,36.44 IC3.11
N$15
  Top 0.406: C7.1 48.45,38.32 47.97,37.84 47.97,35.05 48.48,34.54 IC3.14
N$16
  Top 0.406: IC3.5 51.02,21.84 51.4,21.46 55.72,21.46 57.37,23.11 R5.2
N$17
  Top 0.813: IC3.10 53.56,31.11 54.57,30.09 63.21,30.09 64.35,28.95 64.35,26.92 64.48,26.79 X4.4
N$18
  Top 0.813: R11.1 43.02,19.17 42.89,19.05 LED2.C
N$19
  Top 0.813: R12.1 42.91,31.21 43.02,31.11 42.89,30.98 LED3.C
N$20  (via drill 0.51)
  Top 0.305: v32.6,34.79 32.73,34.67 32.73,26.54 IC5.20 | v38.82,41.02 38.82,42.67 C14.2
  Top 1.397: C14.2 37.18,43.43 37.3,43.3
  Bottom 0.305: v32.6,34.79 v38.82,41.02
N$21
  Top 0.305: JP5.5 R10.1
N$22
  Top 0.305: JP5.4 R9.1
N$23
  Top 0.813: LED4.C R13.2
N$24
  Top 0.813: 40.22,31.11 R14.2 LED8.C
N$25
  Top 0.406: POWER.A 2.25,58.41 2.35,58.52 R15.1
N$31
  Top 0.305: IC5.7 34.38,16.89 34.38,8.88 Q4.2 34.25,7.61 33.74,7.11 33.74,5.33 C12.2
N$32
  Top 0.305: IC5.8 35.4,16.89 35.4,12.57 39.08,8.88 Q4.1 39.59,7.61 40.09,7.11 40.09,5.33 C13.2
N$33
  Top 1.397: 37.05,64.38 X1.1 | 37.05,64.38 34.38,61.72 Q2.4 Q2.2 34.38,53.08 | LED7.C 39.2,62.22 37.05,64.38
N$34
  Top 1.397: 23.2,53.33 Q1.2 Q1.4 23.2,61.72 26.89,65.4 X1.3 26.76,66.29 26.76,64.51 28.03,63.24 LED6.C
N$35
  Top 1.397: 12.03,59.68 Q3.4 | 16.73,64.38 X1.5 | 12.03,59.68 16.73,64.38 | LED5.C 16.88,60.42 16.73,60.57 16.73,64.38 | 12.03,59.68 12.03,59.43 11.27,58.67 Q3.2 11.27,53.33
N$41
  Top 1.397: R31.1 16.6,54.86 16.73,54.99 LED5.A
N$42
  Top 1.397: R29.1 27.93,55.01 28.03,54.86 LED6.A
N$43
  Top 1.397: R30.1 39.31,55.01 39.2,55.11 LED7.A
RESET
  Top 0.305: IC5.29 27.52,21.33 26.25,21.33 22.31,25.27 SV1.5 | 4.47,13.27 3.14,11.93 R7.1 | 4.47,13.27 4.53,13.33 | C15.1 11.52,24.63 10.88,24.63 9.49,23.24 6.57,23.24 5.68,22.35 S1.2 5.04,19.55 5.04,16.12 S1.1 4.53,13.2 4.47,13.27
  Bottom 0.305: SV1.5 21.3,24.38 21.3,23.87 20.41,22.98 20.41,21.97 19.65,21.2 12.03,21.2 10,23.24 6.57,23.24 5.68,22.35 S1.2
RTS#
  Top 0.305: JP5.6 C15.2
RX  (via drill 0.51)
  Top 0.305: v30.57,19.55 29.68,20.44 28.66,20.44 IC5.30 | v10.25,32.38 11.52,31.11 R9.2 | v45.17,57.78 45.81,57.14 IC4.1
  Bottom 0.305: v30.57,19.55 27.01,19.55 26.89,19.68 23.2,19.68 16.6,13.08 13.68,13.08 7.71,19.05 4.41,19.05 3.65,19.81 3.65,22.47 5.42,24.25 6.44,24.25 10.25,28.06 v10.25,32.38 10,32.76 10,35.94 4.79,41.14 4.79,49.14 13.42,57.78 v45.17,57.78
SCL  (via drill 0.51)
  Top 0.305: v24.98,24.38 27.14,22.22 27.52,22.22 IC5.28 | R21.1 18.38,33.01 19.14,33.01 JP4.4
  Bottom 0.305: v24.98,24.38 24.98,28.7 21.81,31.87 JP4.4
SDA  (via drill 0.51)
  Top 0.305: v29.55,22.98 28.66,22.98 IC5.27 | R20.1 18.38,35.55 19.14,35.55 JP4.3
  Bottom 0.305: v29.55,22.98 29.55,23.24 25.62,27.17 25.62,30.6 21.81,34.41 JP4.3
TX  (via drill 0.51)
  Top 0.305: v23.2,22.98 26.38,19.81 27.52,19.81 IC5.31 | 13.55,27.17 13.04,27.17 R10.2 | 13.55,27.17 v15.46,27.17 | v46.06,51.94 46.06,52.83 IC4.4 | v13.17,36.7 13.17,32.89 13.55,32.51 13.55,27.17
  Bottom 0.305: v23.2,22.98 23.2,25.27 21.3,27.17 v15.46,27.17 | v46.06,51.94 46.06,54.22 45.43,54.86 23.58,54.86 13.17,44.45 v13.17,36.7
VCC  (via drill 0.51, 0.6)
  Top 0.305: 31.97,18.16 32.35,18.54 33.24,18.54 | 33.24,18.54 33.49,18.28 33.49,18.03 IC5.6 | 33.24,18.54 33.24,20.7 34.38,21.84 34.38,25.52 IC5.18 | SV2.10 24.22,8.76 24.73,9.27 24.73,12.44 R2.2 24.85,14.22 | 24.85,14.22 SV1.2 | 24.85,14.22 29.17,18.54 31.71,18.54 31.97,18.28 31.97,18.16 | R7.2 5.93,11.93 | R21.2 14.82,34.03 14.82,34.92 R20.2 | 65.18,18.98 64.1,20.06 62.83,20.06 57.62,25.27 R5.1 | 65.18,18.98 67.02,17.14 67.02,10.79 64.6,8.38 58.26,8.38 R4.1 | v50.25,56.26 50.63,56.64 51.02,56.64 IC4.8 | JP4.1 20.41,41.02 R6.2 21.3,43.81 R16.E | 65.18,18.98 67.02,20.82 67.02,30.35 61.68,35.68 C2.+ | v17.23,37.97 15.96,36.7 15.58,36.7 R20.2 | v8.72,35.68 9.87,35.68 12.54,38.35 13.93,38.35 14.57,37.71 14.57,36.7 R20.2 | IC5.4 31.97,17.9 31.97,18.16 | R7.2 4.41,10.16 3.77,10.16 3.26,9.65 1.36,9.65 1.1,9.9 1.1,29.46 4.03,32.38 JP5.3 | v9.23,6.85 5.93,10.16 R7.2 | JP7.2 JP6.2
  Top 1.397: C2.+ 59.92,38.23 63.34,41.65 63.34,43.43 63.21,43.56 C4.1 61.94,43.81 58.76,46.98 | 58.76,46.98 58.77,46.99 IC1.2 | v58.26,43.94 58.26,46.48 58.76,46.98
  Bottom 0.305: SV1.2 18.5,20.06 | v50.25,56.26 56.35,50.16 56.35,49.52 | 52.29,48 40.98,48 40.98,47.87 37.55,44.45 JP6.2 | v17.23,37.97 19.14,39.87 JP4.1 | v8.72,35.68 8.72,34.41 7.84,33.52 6.69,33.52 JP5.3 | v9.23,6.85 21.81,6.85 22.7,7.74 23.2,7.74 SV2.10 | R16.E 24.85,43.56 27.9,43.56 28.79,42.67 30.32,42.67 30.95,43.3 JP7.2
  Bottom 1.397: 52.29,46.1 JP2.2 | 52.29,46.1 JP3.2 | 52.29,46.1 52.16,46.22 | 52.29,46.1 52.29,48 52.29,48.38 53.43,49.52 56.35,49.52 58,49.52 58.51,49.02 58.51,44.19 v58.26,43.94

### Text on the board
tPlace: A+ | A- | B+ | B- | C+ | C- | RS485 | + | POWER | THERMISTOR | NOT ETHERNET! | A7 | A6 | A0 | Its RS485 | + | - | - | D10 | + | - | - | + | - | - | D9 | - | Serial | + | + | + | Extruder Controller | BLK | GND | make.rrrf.org/ec-2.2 | BRN | CTS# | c RRRF.org 2009 | License: GPL v3.0 | RED | VCC | ORG | TXD | V2.2 | YEL | RXD | ICSP | GRN | 2B | RTS# | 2A | 1B | RESET | 1A | Design By: ZachHoeken.com | QUADRATURE